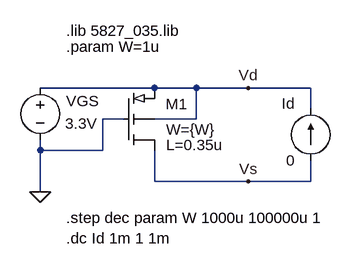
[diagram p0: schematic RonTestPMOS.asc]
RonTestPMOS.asc, the LTspice schematic file:
Version 4
SHEET 1 880 680
WIRE 144 96 -32 96
WIRE 208 96 144 96
WIRE 288 96 208 96
WIRE 384 96 288 96
WIRE 384 128 384 96
WIRE 96 144 64 144
WIRE 208 144 208 96
WIRE 208 144 144 144
WIRE -32 192 -32 176
WIRE 64 192 64 144
WIRE 64 192 -32 192
WIRE 144 240 144 192
WIRE 288 240 144 240
WIRE 384 240 384 208
WIRE 384 240 288 240
WIRE -32 256 -32 192
FLAG -32 256 0
FLAG 288 96 Vd
FLAG 288 240 Vs
SYMBOL voltage -32 80 R0
WINDOW 0 40 36 Left 0
WINDOW 3 38 71 Left 0
WINDOW 123 0 0 Left 0
WINDOW 39 0 0 Left 0
SYMATTR InstName VGS
SYMATTR Value 3.3V
SYMBOL current 384 208 R180
WINDOW 0 24 88 Left 0
WINDOW 3 24 0 Left 0
WINDOW 123 0 0 Left 0
WINDOW 39 0 0 Left 0
SYMATTR InstName Id
SYMATTR Value 0
SYMBOL 5827\\pmos_035 96 96 R0
SYMATTR InstName M1
SYMATTR Value2 W={W}
TEXT 8 296 Left 0 !.step dec param W 1000u 100000u 1
TEXT 8 328 Left 0 !.dc Id 1m 1 1m
TEXT 8 32 Left 0 !.param W=1u
TEXT 8 8 Left 0 !.lib 5827_035.lib

The netlist it stands for:
* RonTestPMOS.asc
VGS Vd 0 3.3V
Id Vs Vd 0
M1 Vs 0 Vd Vd PM W={W} L=0.35u
.model NMOS NMOS
.model PMOS PMOS
.lib standard.mos
.step dec param W 1000u 100000u 1
.dc Id 1m 1 1m
.param W=1u
.lib 5827_035.lib
.backanno
.end